# EAGLE design max7219_breakout (EAGLE 6.2)
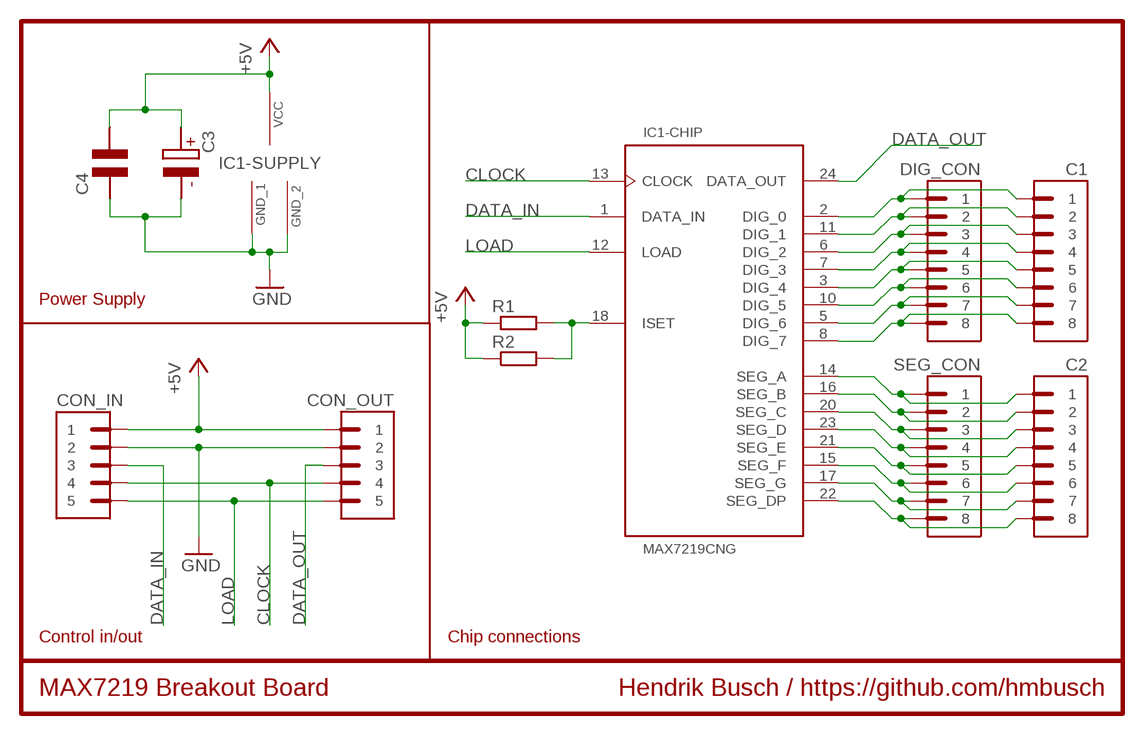
[diagram p0: schematic, sheet 1]

## Parts
C1  PIN_HEADER_8-SCREW-TERMINAL  [TERMINAL_BLOCK_8]
C2  PIN_HEADER_8-SCREW-TERMINAL  [TERMINAL_BLOCK_8]
C3  CAPACITOR_POLARIZED-5X5-2.0  [CAP_POL_5X5_2]
C4  CAPACITOR-CERAMIC-5MM  [CERAMIC_CAP_5MM]
CON_IN  PIN_HEADER_5-WIDE  [BREAKAWAY_STRAIGHT_5_WIDE]
CON_OUT  PIN_HEADER_5-WIDE  [BREAKAWAY_STRAIGHT_5_WIDE]
DIG_CON  PIN_HEADER_8-WIDE  [BREAKAWAY_STRAIGHT_8_WIDE]
IC1  MAX7219CNG  [DIP-24]
R1  RESISTOR-1/4W-12.7-AXIAL  [RESISTOR-1/4W-AXIAL]
R2  RESISTOR-1/4W-12.7-AXIAL  [RESISTOR-1/4W-AXIAL]
SEG_CON  PIN_HEADER_8-WIDE  [BREAKAWAY_STRAIGHT_8_WIDE]

## Nets
+5V: C3.A C4.P$2 CON_IN.1 CON_OUT.1 IC1.19(-SUPPLY:VCC) R1.P$1 R2.P$1
CLOCK: CON_IN.4 CON_OUT.4 IC1.13(-CHIP:CLOCK)
DATA_IN: CON_IN.3 IC1.1(-CHIP:DATA_IN)
DATA_OUT: CON_OUT.3 IC1.24(-CHIP:DATA_OUT)
DIG_0: C1.P$1 DIG_CON.1 IC1.2(-CHIP:DIG_0)
DIG_1: C1.P$2 DIG_CON.2 IC1.11(-CHIP:DIG_1)
DIG_2: C1.P$3 DIG_CON.3 IC1.6(-CHIP:DIG_2)
DIG_3: C1.P$4 DIG_CON.4 IC1.7(-CHIP:DIG_3)
DIG_4: C1.P$5 DIG_CON.5 IC1.3(-CHIP:DIG_4)
DIG_5: C1.P$6 DIG_CON.6 IC1.10(-CHIP:DIG_5)
DIG_6: C1.P$7 DIG_CON.7 IC1.5(-CHIP:DIG_6)
DIG_7: C1.P$8 DIG_CON.8 IC1.8(-CHIP:DIG_7)
GND: C3.C C4.P$1 CON_IN.2 CON_OUT.2 IC1.4(-SUPPLY:GND_1) IC1.9(-SUPPLY:GND_2)
LOAD: CON_IN.5 CON_OUT.5 IC1.12(-CHIP:LOAD)
N$1: IC1.18(-CHIP:ISET) R1.P$2 R2.P$2
SEG_A: C2.P$1 IC1.14(-CHIP:SEG_A) SEG_CON.1
SEG_B: C2.P$2 IC1.16(-CHIP:SEG_B) SEG_CON.2
SEG_C: C2.P$3 IC1.20(-CHIP:SEG_C) SEG_CON.3
SEG_D: C2.P$4 IC1.23(-CHIP:SEG_D) SEG_CON.4
SEG_DP: C2.P$8 IC1.22(-CHIP:SEG_DP) SEG_CON.8
SEG_E: C2.P$5 IC1.21(-CHIP:SEG_E) SEG_CON.5
SEG_F: C2.P$6 IC1.15(-CHIP:SEG_F) SEG_CON.6
SEG_G: C2.P$7 IC1.17(-CHIP:SEG_G) SEG_CON.7

## Notes on the sheet
- Power Supply
- Control in/out | Chip connections
- MAX7219 Breakout Board | Hendrik Busch / https://github.com/hmbusch

## Library data of the parts
C1 C2 DIG_CON SEG_CON = icmi-connectors:PIN_HEADER_8
C3 = icmi-passive-parts:CAPACITOR_POLARIZED: Polarized capacitor, e.g. electrolytic capacitor
C4 = icmi-passive-parts:CAPACITOR: WIMA MKS-2 Metallized Film (PET) Capacitor
CON_IN CON_OUT = icmi-connectors:PIN_HEADER_5
IC1 = icmi-ics:MAX7219: MAX7219 - Serially Interfaced, 8-Digit LED Display Driver
R1 R2 = icmi-passive-parts:RESISTOR-1/4W

## Board
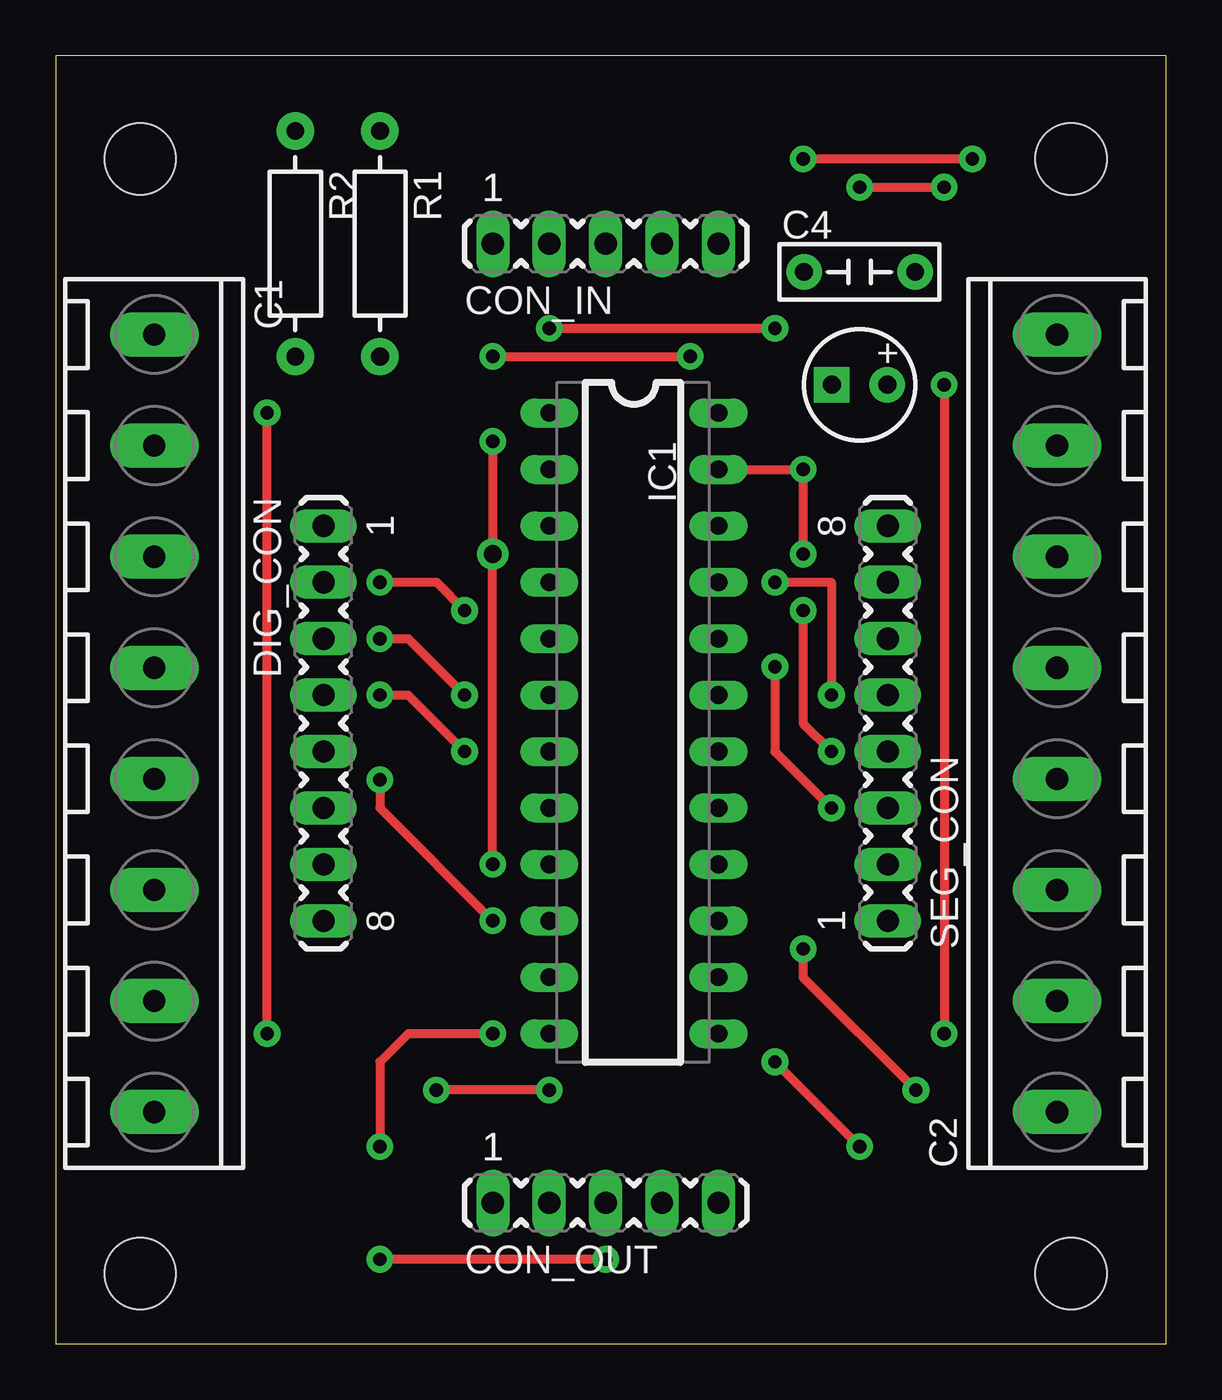
[diagram p1: board, top side]
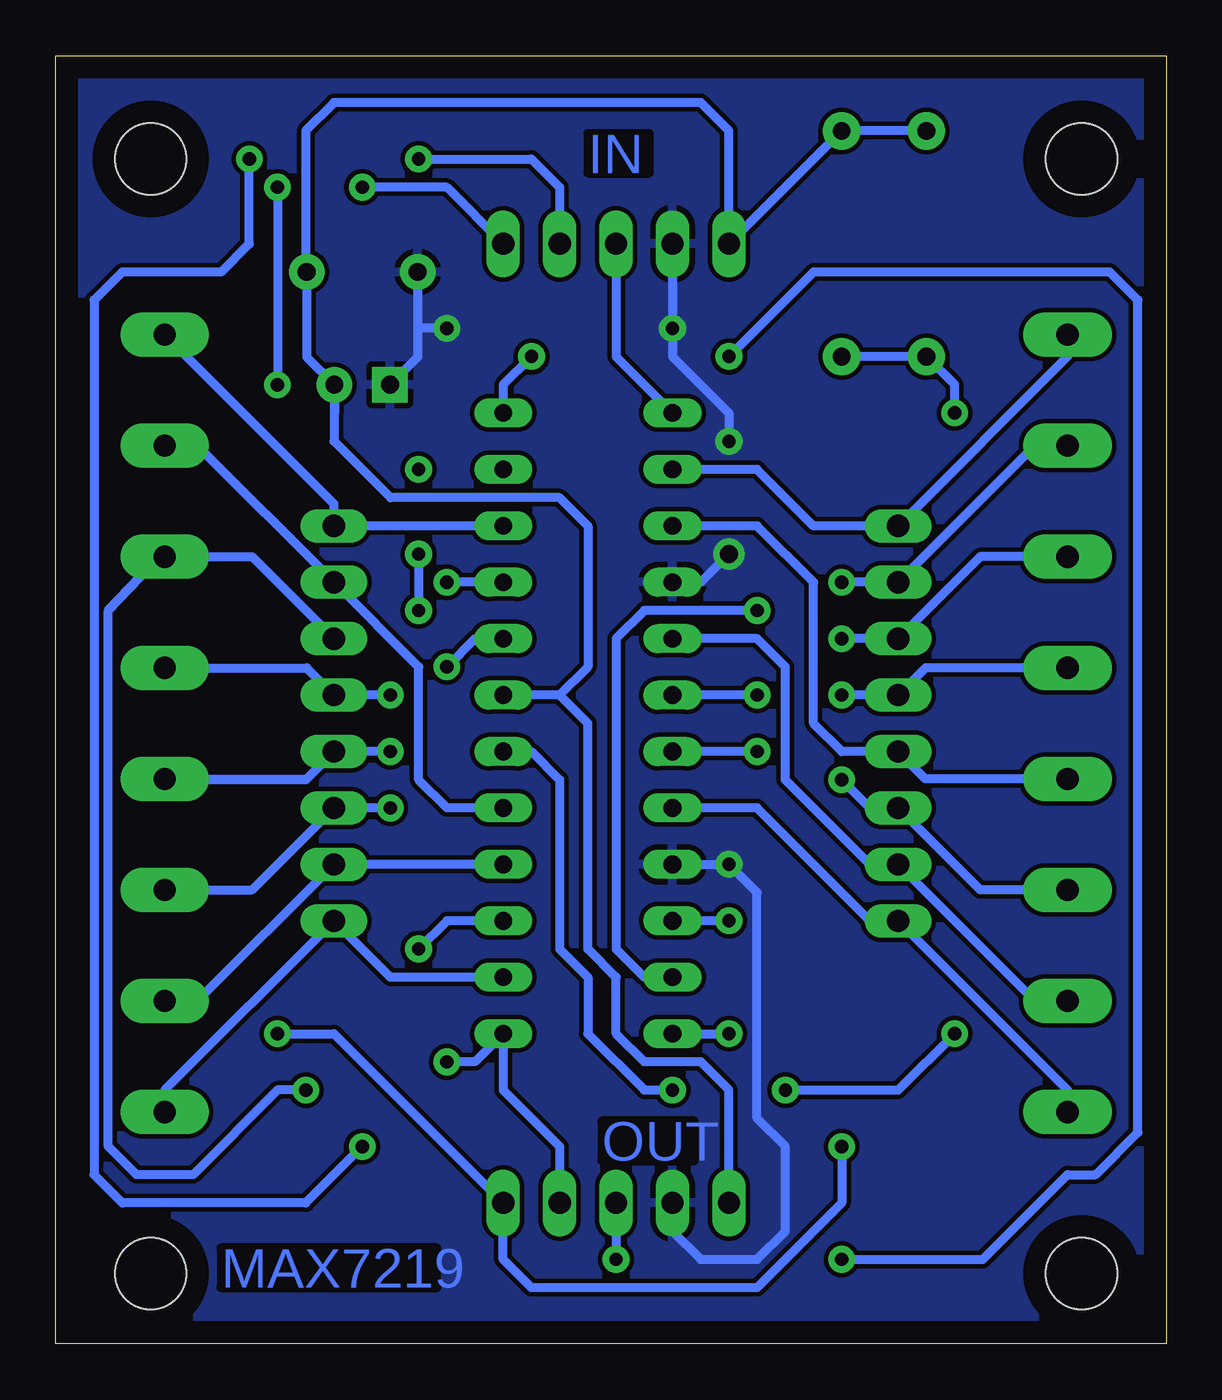
[diagram p2: board, bottom side, seen from below]

Size 50 x 58 mm. Coordinates in mm from the lower left corner, seen from the top.
Outline: 0,0 50,0 50,58 0,58 0,0
Copper layers (1*16): Top 0.035mm / dielectric 1.5mm / Bottom 0.035mm
Design rules: minimum track width 10mil, minimum drill 0.6mm, track to track 8mil, track to pad 8mil, pad to pad 8mil, via to via 8mil, smd to smd 8mil, copper to edge 40mil, drill to drill 8mil, minimum pad ring 10mil, minimum via ring 8mil, stop-mask expansion 4mil, vias tented up to drill 0mil, thermal gap 10mil
Holes 3.2 mm at 3.81,53.34 45.72,53.34 45.72,3.17 3.81,3.17

### Footprints (pad centres in the part's own frame; a part is rotated, then mirrored left to right if it is on the bottom)
TERMINAL_BLOCK_8 = drill 1 pad 2 long: P$1 -17.5,0; P$2 -12.5,0; P$3 -7.5,0; P$4 -2.5,0; P$5 2.5,0; P$6 7.5,0; P$7 12.5,0; P$8 17.5,0
CAP_POL_5X5_2 = drill 0.8 pad 1.6: A 1.25,0 | drill 0.8 pad 1.6 square: C -1.25,0
CERAMIC_CAP_5MM = drill 0.8 pad 1.6: P$1 -2.5,0; P$2 2.5,0
BREAKAWAY_STRAIGHT_5_WIDE = drill 1 long: 1 0,-5.08; 2 0,-2.54; 3 0,0; 4 0,2.54; 5 0,5.08
BREAKAWAY_STRAIGHT_8_WIDE = drill 1 long: 1 0,-8.89; 2 0,-6.35; 3 0,-3.81; 4 0,-1.27; 5 0,1.27; 6 0,3.81; 7 0,6.35; 8 0,8.89
DIP-24 = drill 0.8 long: 1 -13.97,-3.81; 2 -11.43,-3.81; 3 -8.89,-3.81; 4 -6.35,-3.81; 5 -3.81,-3.81; 6 -1.27,-3.81; 7 1.27,-3.81; 8 3.81,-3.81; 9 6.35,-3.81; 10 8.89,-3.81; 11 11.43,-3.81; 12 13.97,-3.81; 13 13.97,3.81; 14 11.43,3.81; 15 8.89,3.81; 16 6.35,3.81; 17 3.81,3.81; 18 1.27,3.81; 19 -1.27,3.81; 20 -3.81,3.81; 21 -6.35,3.81; 22 -8.89,3.81; 23 -11.43,3.81; 24 -13.97,3.81
RESISTOR-1/4W-AXIAL = drill 0.8 pad 1.676: P$1 -5.08,0; P$2 5.08,0

### Placement (x,y rotation side)
C1  4.45,27.94 270 top
C2  45.09,27.94 90 top
C3  36.2,43.18 0 top
C4  36.2,48.26 0 top
CON_IN  24.77,49.53 270 top
CON_OUT  24.77,6.35 270 top
DIG_CON  12.06,27.94 180 top
IC1  26.04,27.94 270 top
R1  14.61,49.53 270 top
R2  10.79,49.53 270 top
SEG_CON  37.47,27.94 0 top

### Tracks (layer width: path | path; a pad name or v marks a point on that pad's centre or on a via)
+5V
  Bottom 0.406: C3.A 38.7,44.43 C4.P$2 38.73,48.3 38.73,54.61 37.47,55.88 20.95,55.88 19.68,54.61 CON_IN.1 R1.P$1 R2.P$1 | CON_OUT.1 19.68,11.43 20.95,12.7 23.5,12.7 24.77,13.97 24.77,16.51 26.04,17.78 26.04,27.94 27.3,29.21 | 27.3,29.21 IC1.19 | C3.A 37.45,41.89 | 27.3,29.21 26.04,30.48 26.04,36.83 27.3,38.1 34.92,38.1 37.47,40.64 37.45,40.66 C3.A
CLOCK  (via drill 0.6 pad 1.2)
  Top 0.406: v32.38,12.7 v36.2,8.89 | v41.27,53.34 v33.66,53.34
  Bottom 0.406: CON_OUT.4 27.3,8.89 29.84,11.43 IC1.13 31.11,12.7 v32.38,12.7 | v36.2,8.89 38.73,6.35 46.99,6.35 48.26,7.62 48.26,46.99 46.99,48.26 42.55,48.26 41.27,49.53 v41.27,53.34 | v33.66,53.34 28.57,53.34 27.3,52.07 CON_IN.4
DATA_IN
  Bottom 0.406: CON_IN.3 24.77,44.45 IC1.1
DATA_OUT  (via drill 0.6 pad 1.2)
  Top 0.406: v24.77,3.81 v14.61,3.81 | v19.68,44.45 v28.57,44.45
  Bottom 0.406: CON_OUT.3 v24.77,3.81 | v14.61,3.81 8.26,3.81 4.45,7.62 3.17,7.62 1.27,9.53 1.27,46.99 2.54,48.26 15.88,48.26 v19.68,44.45 | v28.57,44.45 29.84,43.18 IC1.24
DIG_0
  Bottom 0.406: IC1.2 18.41,39.37 15.88,36.83 DIG_CON.1 4.45,44.45 C1.P$1
DIG_1  (via drill 0.6 pad 1.2)
  Top 0.406: v14.61,34.29 17.14,34.29 v18.41,33.02
  Bottom 0.406: v14.61,34.29 DIG_CON.2 5.92,40.44 C1.P$2 | v18.41,33.02 23.5,33.02 24.77,31.75 24.77,17.78 23.5,16.51 IC1.11
DIG_2  (via drill 0.6 pad 1.2)
  Top 0.406: v14.61,31.75 15.88,31.75 v18.41,29.21
  Bottom 0.406: v14.61,31.75 DIG_CON.3 8.38,35.44 C1.P$3 | v18.41,29.21 IC1.6
DIG_3  (via drill 0.6 pad 1.2)
  Top 0.406: v14.61,29.21 15.88,29.21 v18.41,26.67
  Bottom 0.406: v14.61,29.21 DIG_CON.4 10.84,30.44 C1.P$4 | v18.41,26.67 IC1.7
DIG_4
  Bottom 0.406: IC1.3 18.41,36.83 15.88,34.29 15.88,27.94 14.61,26.67 DIG_CON.5 10.84,25.44 C1.P$5
DIG_5  (via drill 0.6 pad 1.2)
  Top 0.406: v14.61,25.4 14.61,24.13 v19.68,19.05
  Bottom 0.406: v14.61,25.4 13.34,24.13 DIG_CON.6 8.38,20.44 C1.P$6 | v19.68,19.05 IC1.10
DIG_6
  Bottom 0.406: IC1.5 18.41,31.75 17.14,30.48 17.14,25.4 13.34,21.59 DIG_CON.7 5.92,15.44 C1.P$7
DIG_7
  Bottom 0.406: IC1.8 18.41,24.13 13.34,19.05 DIG_CON.8 4.45,11.43 C1.P$8
GND  (via drill 0.6 pad 1.2, 0.8 pad 1.4)
  Top 0.406: v19.68,40.64 v19.68,35.56 v19.68,21.59 | v22.23,45.72 v32.38,45.72
  Bottom 0.406: C4.P$1 33.7,45.72 | 33.7,45.72 33.7,44.43 C3.C | CON_IN.2 v22.23,45.72 22.23,44.45 19.68,41.91 v19.68,40.64 | v19.68,35.56 20.95,34.29 IC1.4 | CON_OUT.2 22.23,5.08 20.95,3.81 18.41,3.81 17.14,5.08 17.14,8.89 18.41,10.16 18.41,20.32 v19.68,21.59 IC1.9 | v32.38,45.72 33.7,45.72
  pour Bottom: 0,58 50,58 50,0 0,0
LOAD  (via drill 0.6 pad 1.2)
  Top 0.406: v36.2,52.07 v40.01,52.07 | v40.01,43.18 v40.01,13.97 | v19.68,13.97 15.88,13.97 14.61,12.7 v14.61,8.89
  Bottom 0.406: v14.61,8.89 14.61,6.35 18.41,2.54 28.57,2.54 29.84,3.81 CON_OUT.5 37.47,13.97 v40.01,13.97 | CON_IN.5 32.38,52.07 v36.2,52.07 | v40.01,52.07 v40.01,43.18 | IC1.12 v19.68,13.97
N$1  (via drill 0.6 pad 1.2)
  Top 0.406: v22.23,11.43 v17.14,11.43 | v9.53,13.97 v9.53,41.91
  Bottom 0.406: R1.P$2 R2.P$2 9.53,43.18 v9.53,41.91 | IC1.18 28.57,26.67 27.3,25.4 27.3,17.78 26.04,16.51 26.04,13.97 23.5,11.43 v22.23,11.43 | v17.14,11.43 12.06,11.43 v9.53,13.97
SEG_A
  Bottom 0.406: C2.P$1 45.09,11.43 SEG_CON.1 34.92,16.51 IC1.14
SEG_B
  Bottom 0.406: IC1.16 SEG_CON.2 43.62,15.44 C2.P$2
SEG_C  (via drill 0.6 pad 1.2)
  Top 0.406: v32.38,30.48 32.38,26.67 v34.92,24.13
  Bottom 0.406: C2.P$3 41.16,20.44 SEG_CON.3 v34.92,24.13 | IC1.20 31.11,31.75 v32.38,30.48
SEG_D  (via drill 0.6 pad 1.2)
  Top 0.406: IC1.23 v33.66,39.37 v33.66,35.56 | v33.66,33.02 33.66,27.94 v34.92,26.67
  Bottom 0.406: C2.P$4 38.7,25.44 SEG_CON.4 | SEG_CON.4 38.73,25.4 45.09,25.4 | v33.66,35.56 v33.66,33.02 | v34.92,26.67 SEG_CON.4
SEG_DP
  Bottom 0.406: IC1.22 SEG_CON.8 37.47,37.82 C2.P$8
SEG_E  (via drill 0.6 pad 1.2)
  Top 0.406: v32.38,34.29 34.92,34.29 v34.92,29.21
  Bottom 0.406: C2.P$5 38.7,30.44 SEG_CON.5 v34.92,29.21 | IC1.21 v32.38,34.29
SEG_F  (via drill 0.6 pad 1.2)
  Top 0.406: v33.66,17.78 33.66,16.51 v38.73,11.43
  Bottom 0.406: SEG_CON.6 41.16,35.44 C2.P$6 45.2,35.56 47.62,33.02 47.62,8.89 46.35,7.62 43.81,7.62 40.01,11.43 v38.73,11.43 | IC1.15 32.38,19.05 v33.66,17.78
SEG_G
  Bottom 0.406: C2.P$7 43.62,40.44 SEG_CON.7 33.66,30.48 33.66,25.4 32.38,24.13 IC1.17

### Text on the board
Bottom: IN | OUT | MAX7219